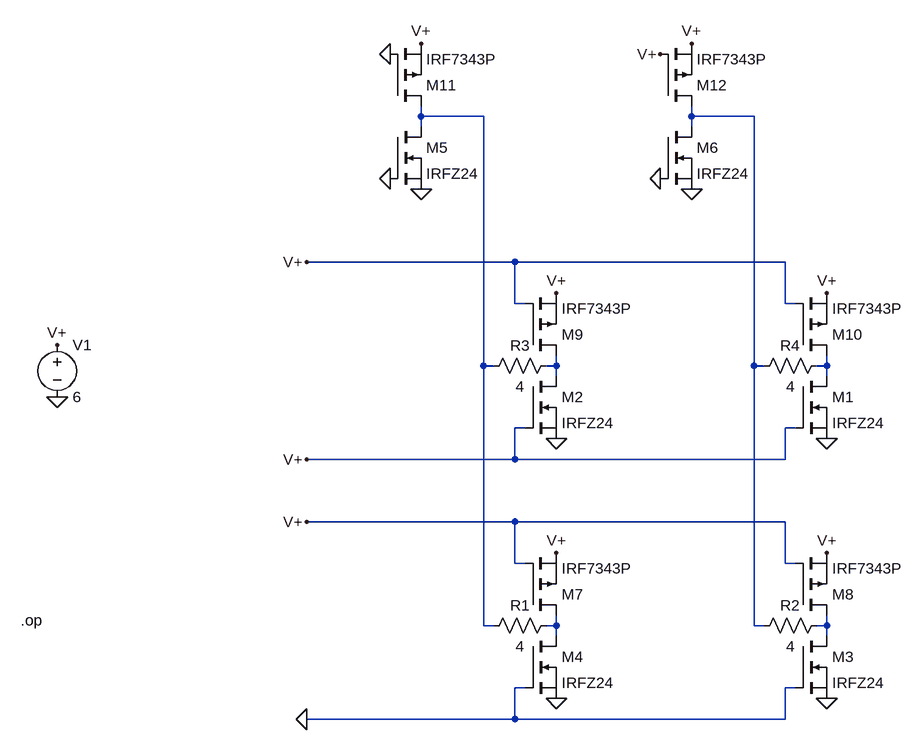
[diagram p0: schematic 7-Segment-Matrix-2.asc]
7-Segment-Matrix-2.asc, the LTspice schematic file:
Version 4
SHEET 1 880 756
WIRE -208 -192 -208 -208
WIRE -112 -192 -208 -192
WIRE 208 -192 208 -208
WIRE 304 -192 208 -192
WIRE -208 -176 -208 -192
WIRE 208 -176 208 -192
WIRE -64 32 -384 32
WIRE 352 32 -64 32
WIRE -64 96 -64 32
WIRE -48 96 -64 96
WIRE 352 96 352 32
WIRE 368 96 352 96
WIRE -112 192 -112 -192
WIRE -96 192 -112 192
WIRE 0 192 0 176
WIRE 0 192 -16 192
WIRE 304 192 304 -192
WIRE 320 192 304 192
WIRE 416 192 416 176
WIRE 416 192 400 192
WIRE 0 208 0 192
WIRE 416 208 416 192
WIRE -48 288 -64 288
WIRE 368 288 352 288
WIRE -64 336 -64 288
WIRE -64 336 -384 336
WIRE 352 336 352 288
WIRE 352 336 -64 336
WIRE -64 432 -384 432
WIRE 352 432 -64 432
WIRE -64 496 -64 432
WIRE -48 496 -64 496
WIRE 352 496 352 432
WIRE 368 496 352 496
WIRE -112 592 -112 192
WIRE -96 592 -112 592
WIRE 0 592 0 576
WIRE 0 592 -16 592
WIRE 304 592 304 192
WIRE 320 592 304 592
WIRE 416 592 416 576
WIRE 416 592 400 592
WIRE 0 608 0 592
WIRE 416 608 416 592
WIRE -48 688 -64 688
WIRE 368 688 352 688
WIRE -64 736 -64 688
WIRE -64 736 -384 736
WIRE 352 736 352 688
WIRE 352 736 -64 736
FLAG -208 -80 0
FLAG 208 -80 0
FLAG 0 304 0
FLAG 416 304 0
FLAG 0 704 0
FLAG 416 704 0
FLAG -768 240 0
FLAG -768 160 V+
FLAG -208 -304 V+
FLAG 208 -304 V+
FLAG 0 80 V+
FLAG 416 80 V+
FLAG 0 480 V+
FLAG 416 480 V+
FLAG -256 -288 0
FLAG -256 -96 0
FLAG 160 -96 0
FLAG -384 736 0
FLAG 160 -288 V+
FLAG -384 32 V+
FLAG -384 336 V+
FLAG -384 432 V+
SYMBOL nmos 368 208 R0
SYMATTR InstName M1
SYMATTR Value IRFZ24
SYMBOL nmos -48 208 R0
SYMATTR InstName M2
SYMATTR Value IRFZ24
SYMBOL nmos 368 608 R0
SYMATTR InstName M3
SYMATTR Value IRFZ24
SYMBOL nmos -48 608 R0
SYMATTR InstName M4
SYMATTR Value IRFZ24
SYMBOL res 0 576 R90
WINDOW 0 0 56 VBottom 2
WINDOW 3 32 56 VTop 2
SYMATTR InstName R1
SYMATTR Value 4
SYMBOL res 416 576 R90
WINDOW 0 0 56 VBottom 2
WINDOW 3 32 56 VTop 2
SYMATTR InstName R2
SYMATTR Value 4
SYMBOL res 0 176 R90
WINDOW 0 0 56 VBottom 2
WINDOW 3 32 56 VTop 2
SYMATTR InstName R3
SYMATTR Value 4
SYMBOL res 416 176 R90
WINDOW 0 0 56 VBottom 2
WINDOW 3 32 56 VTop 2
SYMATTR InstName R4
SYMATTR Value 4
SYMBOL nmos -256 -176 R0
SYMATTR InstName M5
SYMATTR Value IRFZ24
SYMBOL nmos 160 -176 R0
SYMATTR InstName M6
SYMATTR Value IRFZ24
SYMBOL pmos -48 576 M180
SYMATTR InstName M7
SYMATTR Value IRF7343P
SYMBOL pmos 368 576 M180
SYMATTR InstName M8
SYMATTR Value IRF7343P
SYMBOL pmos -48 176 M180
SYMATTR InstName M9
SYMATTR Value IRF7343P
SYMBOL pmos 368 176 M180
SYMATTR InstName M10
SYMATTR Value IRF7343P
SYMBOL pmos -256 -208 M180
SYMATTR InstName M11
SYMATTR Value IRF7343P
SYMBOL pmos 160 -208 M180
SYMATTR InstName M12
SYMATTR Value IRF7343P
SYMBOL voltage -768 144 R0
WINDOW 123 0 0 Left 0
WINDOW 39 0 0 Left 0
SYMATTR InstName V1
SYMATTR Value 6
TEXT -824 584 Left 2 !.op

The netlist it stands for:
* 7-Segment-Matrix-2.asc
M1 N004 V+ 0 0 IRFZ24
M2 N003 V+ 0 0 IRFZ24
M3 N006 0 0 0 IRFZ24
M4 N005 0 0 0 IRFZ24
R1 N005 N001 4
R2 N006 N002 4
R3 N003 N001 4
R4 N004 N002 4
M5 N001 0 0 0 IRFZ24
M6 N002 0 0 0 IRFZ24
M7 N005 V+ V+ V+ IRF7343P
M8 N006 V+ V+ V+ IRF7343P
M9 N003 V+ V+ V+ IRF7343P
M10 N004 V+ V+ V+ IRF7343P
M11 N001 0 V+ V+ IRF7343P
M12 N002 V+ V+ V+ IRF7343P
V1 V+ 0 6
.model NMOS NMOS
.model PMOS PMOS
.lib standard.mos
.op
.backanno
.end